# Altium schematic sheet 1-Power.SCHDOC
size A4
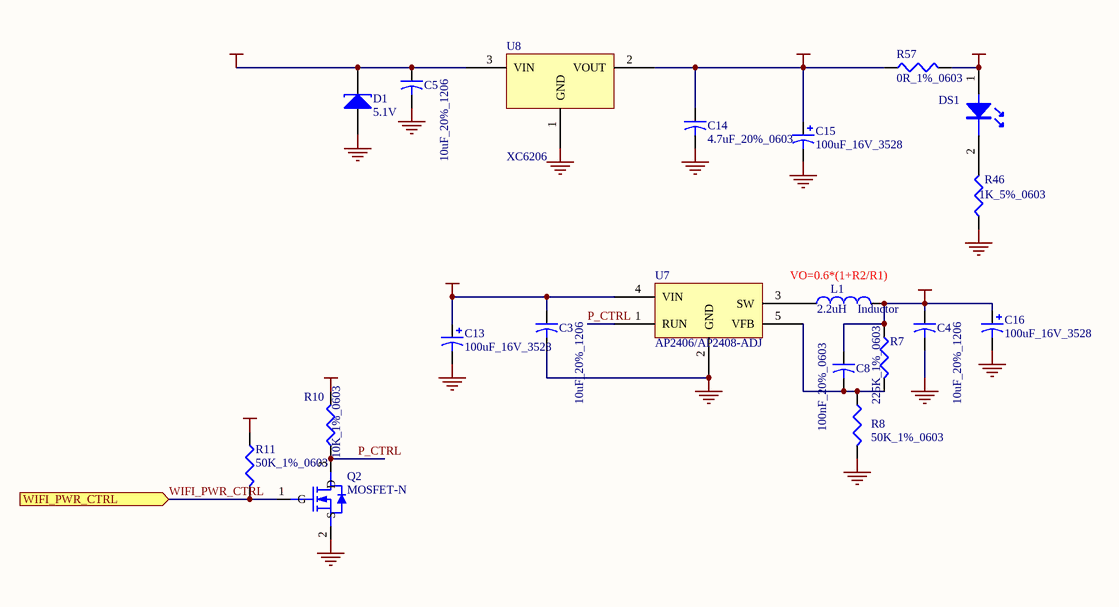
[diagram p0: 1-Power.SCHDOC]

## Parts
C3  10uF_20%_1206  [CC3216-1206]
C4  10uF_20%_1206  [CC3216-1206]
C5  10uF_20%_1206  [CC3216-1206]
C8  100nF_20%_0603  [C1608-0603]
C13  100uF_16V_3528  [CAP_T_B(3528)]
C14  4.7uF_20%_0603  [C1608-0603]
C15  100uF_16V_3528  [CAP_T_B(3528)]
C16  100uF_16V_3528  [CAP_T_B(3528)]
D1  5.1V  [LED0805]
DS1  LED  [LED0805]  (value not drawn)
L1  Inductor  value 2.2uH  [L4x4x2_3A]
Q2  MOSFET-N  [SO-G3/C2.5]
R7  225K_1%_0603  [C1608-0603]
R8  50K_1%_0603  [C1608-0603]
R10  10K_1%_0603  [C1608-0603]
R11  50K_1%_0603  [C1608-0603]
R46  1K_5%_0603  [C1608-0603]
R57  0R_1%_0603  [C1608-0603]
U7  AP2406/AP2408-ADJ  [SOT23-5]
U8  XC6206  [SO-G3/C2.5]

## Ports
WIFI_PWR_CTRL (in)

## Nets
GND: C3.2 C4.2 C5.2 C13.2 C14.2 C15.2 C16.2 D1.1(A) Q2.2(S) R8.2 R46.1 U7.2(GND) U8.1(GND)
V_2V8: C14.1 C15.1 R57.1 U8.2(VOUT)
V_BT4: C3.1 C5.1 C13.1 D1.2(K) R10.2 R11.1 U7.4(VIN) U8.3(VIN)
VCC_2V8: DS1.1 R57.2
VCC_3V3: C4.1 C8.1 C16.1 L1.2 R7.1
P_CTRL: Q2.3(D) R10.1 U7.1(RUN)
WIFI_PWR_CTRL: Q2.1(G) R11.2 ; port WIFI_PWR_CTRL
NetC8_2: C8.2 R7.2 R8.1 U7.5(VFB)
NetDS1_2: DS1.2 R46.2
NetL1_1: L1.1 U7.3(SW)

## Notes on the sheet
- VO=0.6*(1+R2/R1)

## Library data of the parts
C3-C5 = Cap2: Capacitor; Value: 10uF; Published: 23-Sep-2002; Publisher: Altium Limited
C8 = Cap2: Capacitor; Value: 0.1uF; Published: 23-Sep-2002; Publisher: Altium Limited
C13 C15 C16 = Cap Pol2: Polarized Capacitor (Axial); Value: 100uF/16V; Published: 8-Jun-2000; Revision: July-2002: Re-released for DXP Platform.; Publisher: Altium Limited
C14 = Cap2: Capacitor; Value: 0.1uF 20% 0603; Published: 23-Sep-2002; Publisher: Altium Limited
D1 = D Tunnel1: Tunnel Diode - RLC Model; Published: 8-Jun-2000; LatestRevisionDate: 17-Jul-2002; LatestRevisionNote: Re-released for DXP Platform.; Publisher: Altium Limited
R7 R8 R10 R11 R57 = Res3: Resistor; Value: 1K%5 0603; Published: 8-Jun-2000; Revision: July-2002: Re-released for DXP Platform.; Publisher: Altium Limited
R46 = Res3: Resistor; Value: 1K; Published: 8-Jun-2000; Revision: July-2002: Re-released for DXP Platform.; Publisher: Altium Limited
U7 = AP2406
L1 = Inductor: Published: 8-Jun-2000; Revision: July-2002: Re-released for DXP Platform.; Publisher: Altium Limited